# Altium schematic sheet Kodba_Mario.SchDoc
size A4
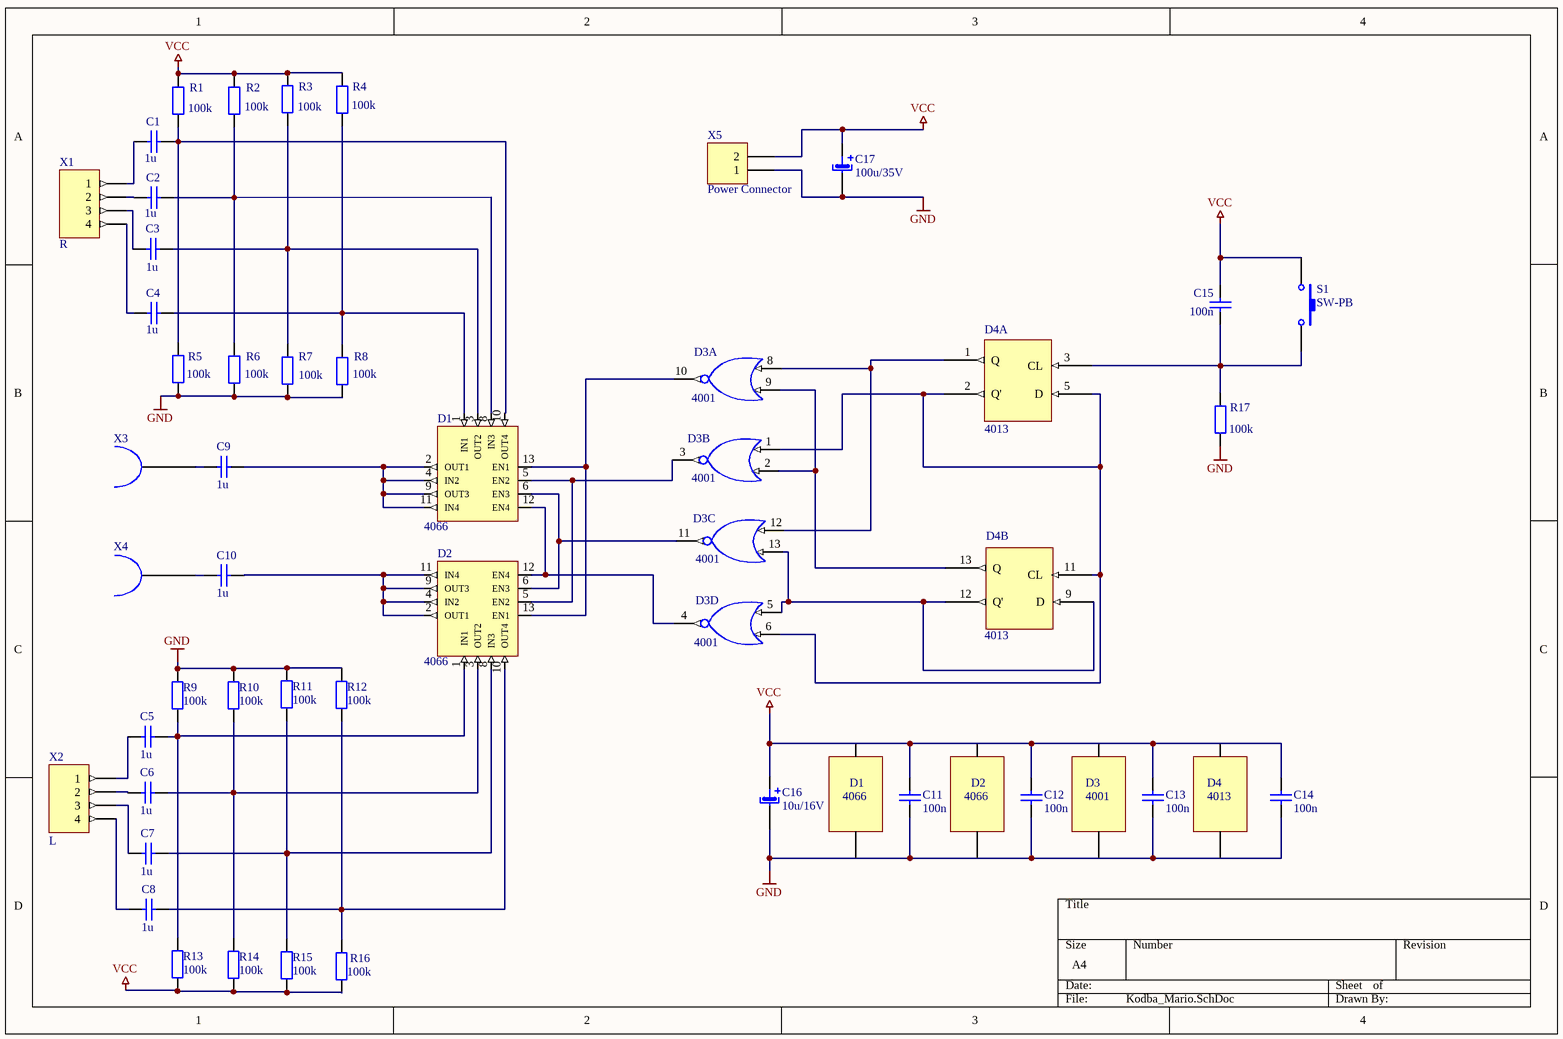
[diagram p0: Kodba_Mario.SchDoc]

## Parts
C1  1u  [CAP-RES-1206]
C2  1u  [CAP-RES-1206]
C3  1u  [CAP-RES-1206]
C4  1u  [CAP-RES-1206]
C5  1u  [CAP-RES-1206]
C6  1u  [CAP-RES-1206]
C7  1u  [CAP-RES-1206]
C8  1u  [CAP-RES-1206]
C9  1u  [CAP-RES-1206]
C10  1u  [CAP-RES-1206]
C11  100n  [CAP-RES-1206]
C12  100n  [CAP-RES-1206]
C13  100n  [CAP-RES-1206]
C14  100n  [CAP-RES-1206]
C15  100n  [CAP-RES-1206]
C16  10u/16V  [POLCap]
C17  100u/35V  [POLCap]
D1  4066  [SOP14]
D2  4066  [SOP14]
D3  4001  [SOP14]  (parts A,B,C,D of 4)
D4  4013  [SOP14]  (parts A,B of 2)
R1  100k  [CAP-RES-1206]
R2  100k  [CAP-RES-1206]
R3  100k  [CAP-RES-1206]
R4  100k  [CAP-RES-1206]
R5  100k  [CAP-RES-1206]
R6  100k  [CAP-RES-1206]
R7  100k  [CAP-RES-1206]
R8  100k  [CAP-RES-1206]
R9  100k  [CAP-RES-1206]
R10  100k  [CAP-RES-1206]
R11  100k  [CAP-RES-1206]
R12  100k  [CAP-RES-1206]
R13  100k  [CAP-RES-1206]
R14  100k  [CAP-RES-1206]
R15  100k  [CAP-RES-1206]
R16  100k  [CAP-RES-1206]
R17  100k  [CAP-RES-1206]
S1  SW-PB  [SPST-2]
X1  Parameter 1: R  [HDR1X4]
X2  Parameter 1: L  [HDR1X4]
X3  (no value)  [PIN1]
X4  (no value)  [PIN1]
X5  Power Connector  [HDR1X2]

## Nets
GND: C11.1 C12.1 C13.1 C14.1 C16.2 C17.2 D1.7(GND) D2.7(GND) D3.7(GND) D4.7(GND) R5.1 R6.1 R7.1 R8.1 R9.2 R10.2 R11.2 R12.2 R17.1 X5.1
VCC: C11.2 C12.2 C13.2 C14.2 C15.2 C16.1 C17.1 D1.14(VCC) D2.14(VCC) D3.14(VCC) D4.14(VDD) R1.2 R2.2 R3.2 R4.2 R13.1 R14.1 R15.1 R16.1 S1.1 X5.2
NetC1_1: C1.1 X1.1
NetC1_2: C1.2 D1.10(OUT4) R1.1 R5.2
NetC2_1: C2.1 X1.2
NetC2_2: C2.2 D1.8(IN3) R2.1 R6.2
NetC3_1: C3.1 X1.3
NetC3_2: C3.2 D1.3(OUT2) R3.1 R7.2
NetC4_1: C4.1 X1.4
NetC4_2: C4.2 D1.1(IN1) R4.1 R8.2
NetC5_1: C5.1 X2.1
NetC5_2: C5.2 D2.1(IN1) R9.1 R13.2
NetC6_1: C6.1 X2.2
NetC6_2: C6.2 D2.3(OUT2) R10.1 R14.2
NetC7_1: C7.1 X2.3
NetC7_2: C7.2 D2.8(IN3) R11.1 R15.2
NetC8_1: C8.1 X2.4
NetC8_2: C8.2 D2.10(OUT4) R12.1 R16.2
NetC9_1: C9.1 X3.1
NetC9_2: C9.2 D1.2(OUT1) D1.4(IN2) D1.9(OUT3) D1.11(IN4)
NetC10_1: C10.1 X4.1
NetC10_2: C10.2 D2.2(OUT1) D2.4(IN2) D2.9(OUT3) D2.11(IN4)
NetC15_1: C15.1 D4.3(CL) R17.2 S1.2
NetD1_5: D1.5(EN2) D2.5(EN2) D3.3
NetD1_6: D1.6(EN3) D2.6(EN3) D3.11
NetD1_12: D1.12(EN4) D2.12(EN4) D3.4
NetD1_13: D1.13(EN1) D2.13(EN1) D3.10
NetD3_1: D3.1 D3.6 D4.2(Q') D4.5(D) D4.11(CL)
NetD3_2: D3.2 D3.9 D4.13(Q)
NetD3_5: D3.5 D3.13 D4.9(D) D4.12(Q')
NetD3_8: D3.8 D3.12 D4.1(Q)

Not connected (* = marked no-connect by the designer): D4 4(R) 6(S) 8(S) 10(R)

## Notes on the sheet
- (near C11) D1
- D2
- D3
- D4
- (near C11) 4066
- 4066
- 4001
- 4013

## Library data of the parts
C1-C3 C6-C8 C10 = Cap: Capacitor; Kat. broj: 2112947; Dobavljač: Farnell; Proizvođač: MULTICOMP; Opis komponente: Kondenzator keramički 1u; Redni broj: 5.; Kućište: CAP-RES-1206; Value: 1u
C4 C5 C9 = Cap: Capacitor; Kat. broj: 2112947; Dobavljač: Farnell; Proizvođač: MULTICOMP; Opis komponente: Kondenzator keramički 1μ; Redni broj: 5.; Kućište: CAP-RES-1206; Value: 1u
C11-C14 = Cap: Capacitor; Kat. broj: 1702665; Dobavljač: Farnell; Proizvođač: KEMET; Opis komponente: Blokadni kondenzator keramicki 100n; Redni broj: 8.; Kućište: CAP-RES-1206; Value: 100n
C15 = Cap: Capacitor; Kat. broj: 2819609; Dobavljač: Farnell; Proizvođač: KEMET; Opis komponente: Kondenzator keramički 100n; Redni broj: 8.; Kućište: CAP-RES-1206; Value: 100n
C16 = Elektrolitski_kondenzator: Kat. broj: 8766894; Dobavljač: Farnell; Proizvođač: MULTICOMP; Opis komponente: Elektrolitski kondenzator 10μ /16V ± 20%; Redni broj: 6.; Value: 10u; Kućište: POLCap
C17 = Elektrolitski_kondenzator: Kat. broj: 8766894; Dobavljač: Farnell; Proizvođač: MULTICOMP; Opis komponente: Elektrolitski kondenzator 100u /35V ± 20%; Redni broj: 7.; Value: 100u; Kućište: POLCap
D1 D2 = 4066: Dobavljač: Chipoteka; Kat. broj: 0000406601; Opis komponente: Cetverokanalna sklopka; Redni broj: 1.; Kućište: SOP14; Proizvođač: -
D3 = 4001: Dobavljač: Chipoteka; Kat. broj: 0000400101; Opis komponente: Cetveroulazna NOR vrata; Redni broj: 2.; Kućište: SOP14; Proizvođač: -
R1-R17 = Res2: Resistor; Kat. broj: 9341129; Dobavljač: Farnell; Proizvođač: MULTICOMP; Opis komponente: Otpornik 100k / 0.25W, ± 1%; Redni broj: 4.; Kućište: CAP-RES-1206; Value: 100k
S1 = SW-PB: Switch; Kat. broj: 1206168; Dobavljač: Farnell; Proizvođač: CARLING TECHNOLOGIES; Opis komponente: Tipkalo; Redni broj: 12.; Kućište: SPST-2
X1 X2 = Header 4: -; Redni broj: 9.; Dobavljač: Farnell; Opis komponente: Četverokanalni konektor; Kat. broj: 1708334; Proizvođač: MULTICOMP; Kućište: HDR1X4
X3 = ConnectorPin: ROUT; Redni broj: 11.; Dobavljač: Farnell; Kat. broj: 9731148; Opis komponente: Konektor; Proizvođač: -; Kućište: PIN1
X4 = ConnectorPin: LOUT; Redni broj: 11.; Dobavljač: Farnell; Kat. broj: 9731148; Opis komponente: Konektor; Proizvođač: -; Kućište: PIN1
X5 = Header 2: Header, 2-Pin; Redni broj: 10.; Opis komponente: Dvokanalni konektor; Dobavljač: Farnell; Kat. broj: 9731148; LatestRevisionDate: 17-Jul-2002; LatestRevisionNote: Re-released for DXP Platform.; Publisher: Altium Limited; Proizvođač: -; Kućište: HDR1X2